# Altium schematic sheet ups.SchDoc
size A4
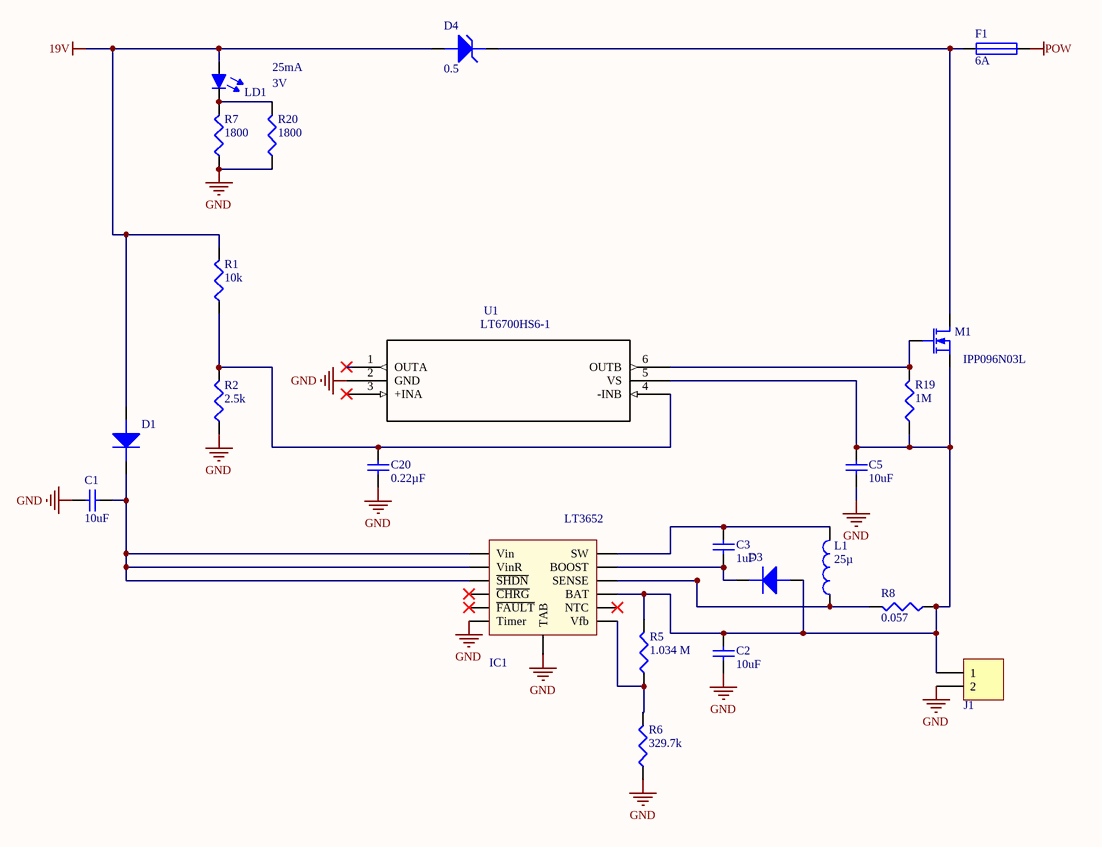
[diagram p0: ups.SchDoc]

## Parts
C1  10uF  [0805 CAP]
C2  10uF  [0805 CAP]
C3  1uF  [0805 CAP]
C5  10uF  [0805 CAP]
C20  0.22µF  [0805 CAP]
D1  Diode  [SMB]  (value not drawn)
D3  Diode  [SMB]  (value not drawn)
D4  Voltage: 0.5  [DIODE-0.4]  (hidden comment: Diode Zener)
F1  value 6A  [Fuse_holder]  (hidden comment: Fusible)
IC1  LT3652  [MSOP12 - EP]
J1  Connecteur 2  [Terminal block - 2 ways]  (value not drawn)
L1  value 25µ  [INDPM7070X580N]  (hidden comment: Inductance)
LD1  Forward Current If: 25mA  Forward Voltage: 3V  [LED_0603]  (hidden comment: LED diode)
M1  IPP096N03L  [TO-220 V]
R1  value 10k  [0603 RES]  (hidden comment: Résistance)
R2  value 2.5k  [0603 RES]  (hidden comment: Résistance)
R5  value 1.034 M  [0603 RES]  (hidden comment: Résistance)
R6  value 329.7k  [0603 RES]  (hidden comment: Résistance)
R7  value 1800  [1206 RES]  (hidden comment: Résistance)
R8  value 0.057  [1812 RES]  (hidden comment: Résistance)
R19  value 1M  [0603 RES]  (hidden comment: Résistance)
R20  value 1800  [1206 RES]  (hidden comment: Résistance)
U1  LT6700HS6-1  [*TSOT-23_S6]

## Nets
19V: D1.1(A) D4.1(A) LD1.1(A1) R1.2
GND: C1.2 C2.2 C5.1 C20.2 IC1.6(Timer) IC1.13(TAB) J1.2 R2.1 R6.1 R7.1 R20.1 U1.2(GND)
POW: F1.2(F2)
NetC1_1: C1.1 D1.2(K) IC1.1(Vin) IC1.2(VinR) IC1.3(~{SHDN})
NetC2_1: C2.1 C5.2 D3.1(A) IC1.9(BAT) J1.1 M1.3(S) R5.2 R8.1 R19.1 U1.5(VS)
NetC3_1: C3.1 D3.2(K) IC1.11(BOOST)
NetC3_2: C3.2 IC1.12(SW) L1.2
NetC20_1: C20.1 R1.1 R2.2 U1.4(-INB)
NetD4_2: D4.2(K) F1.1(F1) M1.2(D)
NetIC1_7: IC1.7(Vfb) R5.1 R6.2
NetIC1_10: IC1.10(SENSE) L1.1 R8.2
NetLD1_2: LD1.2(K) R7.2 R20.2
NetM1_1: M1.1(G) R19.2 U1.6(OUTB)

Not connected (* = marked no-connect by the designer): IC1 4(~{CHRG})* 5(~{FAULT})* 8(NTC)*; U1 1(OUTA)* 3(+INA)*

## Library data of the parts
C1 C2 = 1uF/0805: Manufacturer: Murata; Manufacturer Part Number: GCM21BR7YA105KA55L; Capacitance: 10 µF; Dielectric: X7R; Tolerance (%): ±10 %; Rated Voltage: 35 V; Supplier 1: Farnell; Stock 1: 3630; Pricing 1: 5=0.391, 50=0.21, 250=0.162, 500=0.111 (EUR); Case Size/Dimension: 0805; ComponentLink1URL: https://datasheet.ciiva.com/11616/product-11616620.pdf; ComponentLink1Description: https://datasheet.ciiva.com/11616/product-11616620.pdf; ComponentLink2URL: https://datasheet.ciiva.com/138/s0717e-138752.pdf; ComponentLink2Description: https://datasheet.ciiva.com/138/s0717e-138752.pdf; ComponentLink3URL: https://datasheet.ciiva.com/138/s0717e-138753.pdf; ComponentLink3Description: https://datasheet.ciiva.com/138/s0717e-138753.pdf; ComponentLink4URL: https://datasheet.ciiva.com/18183/getdatasheetpartid-251151-18183719.pdf; ComponentLink4Description: https://datasheet.ciiva.com/18183/getdatasheetpartid-251151-18183719.pdf; ComponentLink5URL: https://datasheet.ciiva.com/138/s0717e-138751.pdf; ComponentLink5Description: https://datasheet.ciiva.com/138/s0717e-138751.pdf; Supplier Part Number 1: 2494199
C3 C5 = 1uF/0805: Manufacturer: Murata; Manufacturer Part Number: GCM21BR7YA105KA55L; Capacitance: 1 µF; Dielectric: X7R; Tolerance (%): ±10 %; Rated Voltage: 35 V; Supplier 1: Farnell; Stock 1: 3630; Pricing 1: 5=0.391, 50=0.21, 250=0.162, 500=0.111 (EUR); Case Size/Dimension: 0805; ComponentLink1URL: https://datasheet.ciiva.com/11616/product-11616620.pdf; ComponentLink1Description: https://datasheet.ciiva.com/11616/product-11616620.pdf; ComponentLink2URL: https://datasheet.ciiva.com/138/s0717e-138752.pdf; ComponentLink2Description: https://datasheet.ciiva.com/138/s0717e-138752.pdf; ComponentLink3URL: https://datasheet.ciiva.com/138/s0717e-138753.pdf; ComponentLink3Description: https://datasheet.ciiva.com/138/s0717e-138753.pdf; ComponentLink4URL: https://datasheet.ciiva.com/18183/getdatasheetpartid-251151-18183719.pdf; ComponentLink4Description: https://datasheet.ciiva.com/18183/getdatasheetpartid-251151-18183719.pdf; ComponentLink5URL: https://datasheet.ciiva.com/138/s0717e-138751.pdf; ComponentLink5Description: https://datasheet.ciiva.com/138/s0717e-138751.pdf; Supplier Part Number 1: 2494199
C20 = 1uF/0805: Manufacturer: Murata; Manufacturer Part Number: GCM21BR7YA105KA55L; Capacitance: 220 nF; Dielectric: X7R; Tolerance (%): ±10 %; Rated Voltage: 35 V; Supplier 1: Farnell; Stock 1: 3630; Pricing 1: 5=0.391, 50=0.21, 250=0.162, 500=0.111 (EUR); Case Size/Dimension: 0805; ComponentLink1URL: https://datasheet.ciiva.com/11616/product-11616620.pdf; ComponentLink1Description: https://datasheet.ciiva.com/11616/product-11616620.pdf; ComponentLink2URL: https://datasheet.ciiva.com/138/s0717e-138752.pdf; ComponentLink2Description: https://datasheet.ciiva.com/138/s0717e-138752.pdf; ComponentLink3URL: https://datasheet.ciiva.com/138/s0717e-138753.pdf; ComponentLink3Description: https://datasheet.ciiva.com/138/s0717e-138753.pdf; ComponentLink4URL: https://datasheet.ciiva.com/18183/getdatasheetpartid-251151-18183719.pdf; ComponentLink4Description: https://datasheet.ciiva.com/18183/getdatasheetpartid-251151-18183719.pdf; ComponentLink5URL: https://datasheet.ciiva.com/138/s0717e-138751.pdf; ComponentLink5Description: https://datasheet.ciiva.com/138/s0717e-138751.pdf; Supplier Part Number 1: 2494199
D1 D3 = Diode: Type: Diode standard; Designer: ECAM 2003
D4 = Diode Zener: Diode Zéner; Type: Diode Zéner 10 V; Designer: ECAM 2005
IC1 = LTC3652: Manufacturer: Analog Devices / Linear Technology; Manufacturer Part Number: LT3652EMSE#PBF; Dynamic Catalog: Charge Management, Specialized; Other Related Documents: Power-Tracking Batt-Charger Article / Designing a Solar Cell Battery Charger; Product Training Modules: LT3652 Multi-Chemistry Battery Charger for Solar Power; Featured Product: Energy Harvesting Power Products; Reference Design Library: DC1568A(#1):  2 Cell, 8.2V, 2A Max, Solar / DC1568A(#2):  2 Cell, 8.2V, 2A Max, Solar; Function: Charge Management, Solar; Battery Chemistry: Lead Acid, LiFePO4, Li-Ion, Li-Pol, NiCd, NiMH; Voltage - Supply: 4.95 V ~ 32 V; For Use With: DC1568A-ND / - BOARD BATTERY CHARGER SOLAR PWR / DC1688A-ND / - EVAL BOARD BATT CHARGER LT3652; Other Names: LT3652EMSEPBF; Value: LTC3652; Supplier 1: Farnell; Stock 1: 0; Standard Package: 37; Category: Integrated Circuits (ICs); Family: PMIC - Battery Management; Series: -; Packaging: Tube; Operating Temperature: -40°C ~ 125°C; Mounting Type: Surface Mount; Package / Case: 12-TSSOP (0.118", 3.00mm Width) Exposed Pad; Supplier Device Package: 12-MSOP-EP; Online Catalog: Charge Management, Specialized; ComponentLink1URL: https://datasheet.ciiva.com/15114/getdatasheetpartid-367678-15114671.pdf; ComponentLink1Description: https://datasheet.ciiva.com/15114/getdatasheetpartid-367678-15114671.pdf; ComponentLink2URL: https://datasheet.ciiva.com/1932/28522-1932092.pdf; ComponentLink2Description: https://datasheet.ciiva.com/1932/28522-1932092.pdf; ComponentLink3URL: https://datasheet.ciiva.com/1139/1692510-1139705.pdf; ComponentLink3Description: https://datasheet.ciiva.com/1139/1692510-1139705.pdf; Supplier Part Number 1: 1839126
J1 = Connecteur 2: Connecteur; Designer: ECAM 2005; Type: Connecteur à vis
LD1 = LED diode: LED; Manufacturer: Multicomp; Manufacturer Part Number: 703-0112; LED Colour: Red; LED Mounting: SMD; Wavelength Typ: 643nm; Luminous Intensity: 15mcd; Viewing Angle: 140°; Lens Shape: Rectangular; Supplier 1: Farnell; Stock 1: 627; Pricing 1: 5=0.163, 25=0.139, 100=0.108, 250=0.0887, 500=0.0813, 1000=0.075 (EUR); Bulb Size: -; Packaging: Each; Product Range: -; Automotive Qualification Standard: -; ComponentLink1URL: https://datasheet.ciiva.com/1244/1758066-1244070.pdf; ComponentLink1Description: https://datasheet.ciiva.com/1244/1758066-1244070.pdf; ComponentLink2URL: https://datasheet.ciiva.com/23621/1626779-23621468.pdf; ComponentLink2Description: https://datasheet.ciiva.com/23621/1626779-23621468.pdf; Supplier Part Number 1: 2112124
M1 = NMOS-IPP096: MOSFET; Value: NMOS; Designer: ECAM 2002; Type: Mosfet canal N
R1 R2 R5-R8 R19 R20 = Résistance: Résistance standard; Designer: ECAM 2005; Type: Résistance standard
U1 = LT6700HS6-1: Analog Comparators LT6700 - Micropower, Low Voltage, Dual Comparator with 400mV Reference; MF: Linear Technology; MP: LT6700HS6-1; Package: None; Price: None; Availability: Unavailable; SnapEDA_Link: https://www.snapeda.com/parts/LT6700HS6-1/Analog%20Devices/view-part/?ref=snap; Value: *
F1 = Fusible: Designer: ECAM 2004; Type: Fusible
L1 = Inductance: Designer: ECAM 2003